# Altium project FLOOD_DATN.PrjPcb
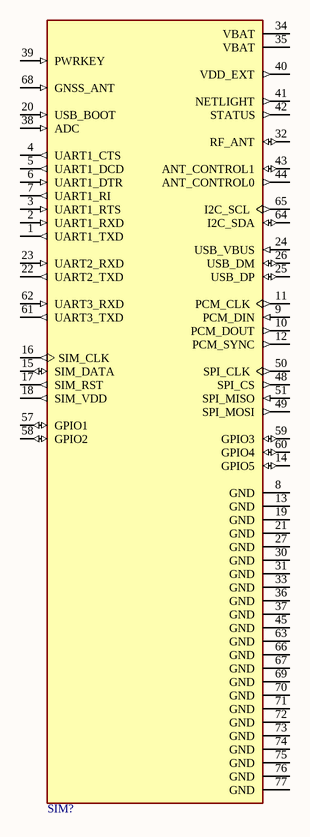
[diagram p0: Gateway.SchDoc]
6 sheets, 1 parts. Net scope: global (net labels, ports and power ports of the same name join across sheets).
Sheets:
  Mechanical.SchDoc
  Technical.SchDoc
  Power.SchDoc
  Gateway.SchDoc
  MCU.SchDoc
  Sensor.SchDoc

## Sheet Mechanical.SchDoc
size A; SheetNumber: 1; SheetTotal: 1

## Sheet Technical.SchDoc
size A; SheetNumber: 2; SheetTotal: 2

## Sheet Power.SchDoc
size A; SheetNumber: 3; SheetTotal: 3

## Sheet Gateway.SchDoc
size B; SheetNumber: 4; SheetTotal: 6

### Parts
SIM?  RF TXRX MOD CELL NAV SMD  [SIM7080G]  (value not drawn)

### Nets

Not connected (* = marked no-connect by the designer): SIM? 1(UART1_TXD) 2(UART1_RXD) 3(UART1_RTS) 4(UART1_CTS) 5(UART1_DCD) 6(UART1_DTR) 7(UART1_RI) 8(GND) 9(PCM_DIN) 10(PCM_DOUT) 11(PCM_CLK) 12(PCM_SYNC) 13(GND) 14(GPIO5) 15(SIM_DATA) 16(SIM_CLK) 17(SIM_RST) 18(SIM_VDD) 19(GND) 20(USB_BOOT) 21(GND) 22(UART2_TXD) 23(UART2_RXD) 24(USB_VBUS) 25(USB_DP) 26(USB_DM) 27(GND) 30(GND) 31(GND) 32(RF_ANT) 33(GND) 34(VBAT) 35(VBAT) 36(GND) 37(GND) 38(ADC) 39(PWRKEY) 40(VDD_EXT) 41(NETLIGHT) 42(STATUS) 43(ANT_CONTROL1) 44(ANT_CONTROL0) 45(GND) 48(SPI_CS) 49(SPI_MOSI) 50(SPI_CLK) 51(SPI_MISO) 57(GPIO1) 58(GPIO2) 59(GPIO3) 60(GPIO4) 61(UART3_TXD) 62(UART3_RXD) 63(GND) 64(I2C_SDA) 65(I2C_SCL) 66(GND) 67(GND) 68(GNSS_ANT) 69(GND) 70(GND) 71(GND) 72(GND) 73(GND) 74(GND) 75(GND) 76(GND) 77(GND)

### Library data of the parts
SIM? = SIM7080G: CAT-M and NB-IoT Module 600MHz/700MHz/800MHz/850MHz/900MHz/1700MHz/1800MHz/1900MHz/2100MHz 2.7V to 4.8V LCC+LGA; Manufacturer: Simcom; Library MADE By: Cong Le; Supplier: Digikey; Supplier Part Number: 3781-SIM7080G-ND; Manufacturer Part Number: SIM7080G; RoHS: No; Category: LDO; Stock: 865; Pricing: 1=22.62, 10=19.724, 25=18.7208, 100=17.3446, 250=16.52136, 500=15.94076 (USD); Manufacture Cross: *; Manufacture Part Number Cross: *; ComponentLink1Description: Link Original; ComponentLink1URL: https://www.digikey.com/en/products/detail/simcom-wireless-solutions-limited/SIM7080G/15841448; ComponentLink2Description: Link Cross; ComponentLink2URL: *; ComponentLink3Description: Link Viet Nam; ComponentLink3URL: https://linhkien.cxtvn.com/6535-sim7080g-cat-mnb-iot.html

## Sheet MCU.SchDoc
size A; SheetNumber: 5; SheetTotal: 5

## Sheet Sensor.SchDoc
size A; SheetNumber: 6; SheetTotal: 6